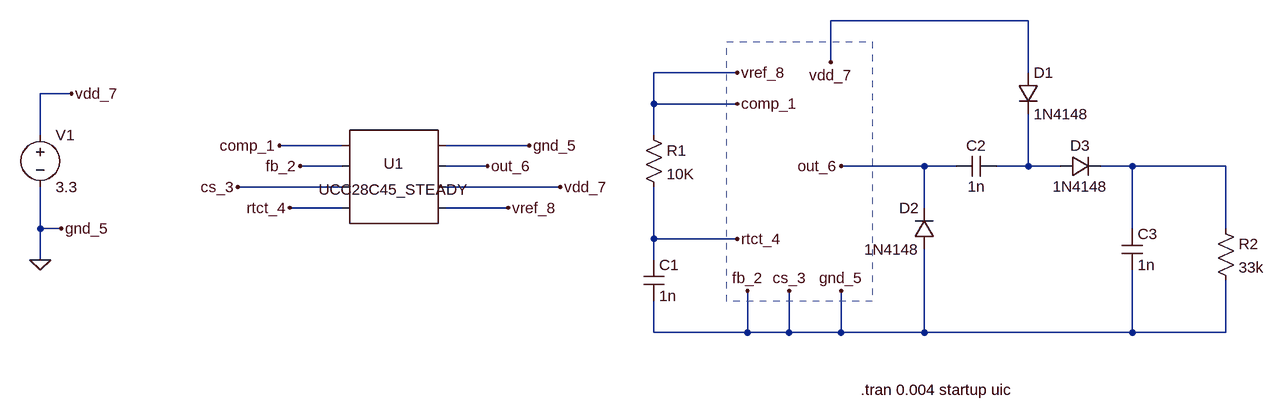
[diagram p0: schematic 28c45_test.asc]
28c45_test.asc, the LTspice schematic file:
Version 4
SHEET 1 1524 680
WIRE 1152 -672 848 -672
WIRE 848 -608 848 -672
WIRE 704 -592 576 -592
WIRE 1152 -592 1152 -672
WIRE -320 -560 -368 -560
WIRE 576 -544 576 -592
WIRE 704 -544 576 -544
WIRE -368 -496 -368 -560
WIRE 576 -496 576 -544
WIRE 96 -480 0 -480
WIRE 384 -480 256 -480
WIRE 96 -448 32 -448
WIRE 320 -448 256 -448
WIRE 992 -448 864 -448
WIRE 1040 -448 992 -448
WIRE 1152 -448 1152 -528
WIRE 1152 -448 1104 -448
WIRE 1200 -448 1152 -448
WIRE 1312 -448 1264 -448
WIRE 1456 -448 1312 -448
WIRE 96 -416 -64 -416
WIRE 432 -416 256 -416
WIRE 96 -384 16 -384
WIRE 352 -384 256 -384
WIRE 992 -384 992 -448
WIRE -368 -352 -368 -416
WIRE -336 -352 -368 -352
WIRE 1312 -352 1312 -448
WIRE 1456 -352 1456 -448
WIRE 576 -336 576 -416
WIRE 704 -336 576 -336
WIRE -368 -304 -368 -352
WIRE 576 -304 576 -336
WIRE 576 -192 576 -240
WIRE 720 -192 720 -256
WIRE 720 -192 576 -192
WIRE 784 -192 784 -256
WIRE 784 -192 720 -192
WIRE 864 -192 864 -256
WIRE 864 -192 784 -192
WIRE 992 -192 992 -320
WIRE 992 -192 864 -192
WIRE 1312 -192 1312 -288
WIRE 1312 -192 992 -192
WIRE 1456 -192 1456 -272
WIRE 1456 -192 1312 -192
FLAG -368 -304 0
FLAG 0 -480 comp_1
FLAG 32 -448 fb_2
FLAG -64 -416 cs_3
FLAG 16 -384 rtct_4
FLAG 384 -480 gnd_5
FLAG 320 -448 out_6
FLAG 432 -416 vdd_7
FLAG 352 -384 vref_8
FLAG -336 -352 gnd_5
FLAG -320 -560 vdd_7
FLAG 704 -592 vref_8
FLAG 704 -544 comp_1
FLAG 704 -336 rtct_4
FLAG 720 -256 fb_2
FLAG 784 -256 cs_3
FLAG 864 -256 gnd_5
FLAG 864 -448 out_6
FLAG 848 -608 vdd_7
SYMBOL AutoGenerated\\UCC28C45_STEADY 176 -432 R0
SYMATTR InstName U1
SYMBOL voltage -368 -512 R0
WINDOW 123 0 0 Left 0
WINDOW 39 24 124 Left 2
SYMATTR InstName V1
SYMATTR Value 3.3
SYMBOL res 560 -512 R0
SYMATTR InstName R1
SYMATTR Value 10K
SYMBOL cap 560 -304 R0
SYMATTR InstName C1
SYMATTR Value 1n
SYMBOL diode 1136 -592 R0
SYMATTR InstName D1
SYMATTR Value 1N4148
SYMBOL cap 1104 -464 R90
WINDOW 0 0 32 VBottom 2
WINDOW 3 32 32 VTop 2
SYMATTR InstName C2
SYMATTR Value 1n
SYMBOL diode 1008 -320 R180
WINDOW 0 24 64 Left 2
WINDOW 3 24 0 Left 2
SYMATTR InstName D2
SYMATTR Value 1N4148
SYMBOL diode 1200 -432 R270
WINDOW 0 32 32 VTop 2
WINDOW 3 0 32 VBottom 2
SYMATTR InstName D3
SYMATTR Value 1N4148
SYMBOL cap 1296 -352 R0
SYMATTR InstName C3
SYMATTR Value 1n
SYMBOL res 1440 -368 R0
SYMATTR InstName R2
SYMATTR Value 33k
TEXT 894 -104 Left 2 !.tran 0.004 startup uic
RECTANGLE Normal 912 -240 688 -640 2

The netlist it stands for:
* 28c45_test.asc
* U1: UCC28C45_STEADY (symbol AutoGenerated\UCC28C45_STEADY not available, pins judged from their places): pin1=vref_8 pin2=0 pin3=0 pin4=rtct_4 pin5=0 pin6=out_6 pin7=vdd_7 pin8=vref_8
V1 vdd_7 0 3.3
R1 vref_8 rtct_4 10K
C1 rtct_4 0 1n
D1 vdd_7 N001 1N4148
C2 N001 out_6 1n
D2 0 out_6 1N4148
D3 N001 N002 1N4148
C3 N002 0 1n
R2 N002 0 33k
.model D D
.lib standard.dio
.tran 0.004 startup uic
.backanno
.end